# EAGLE design PCM-DAC (EAGLE 7.3.0)
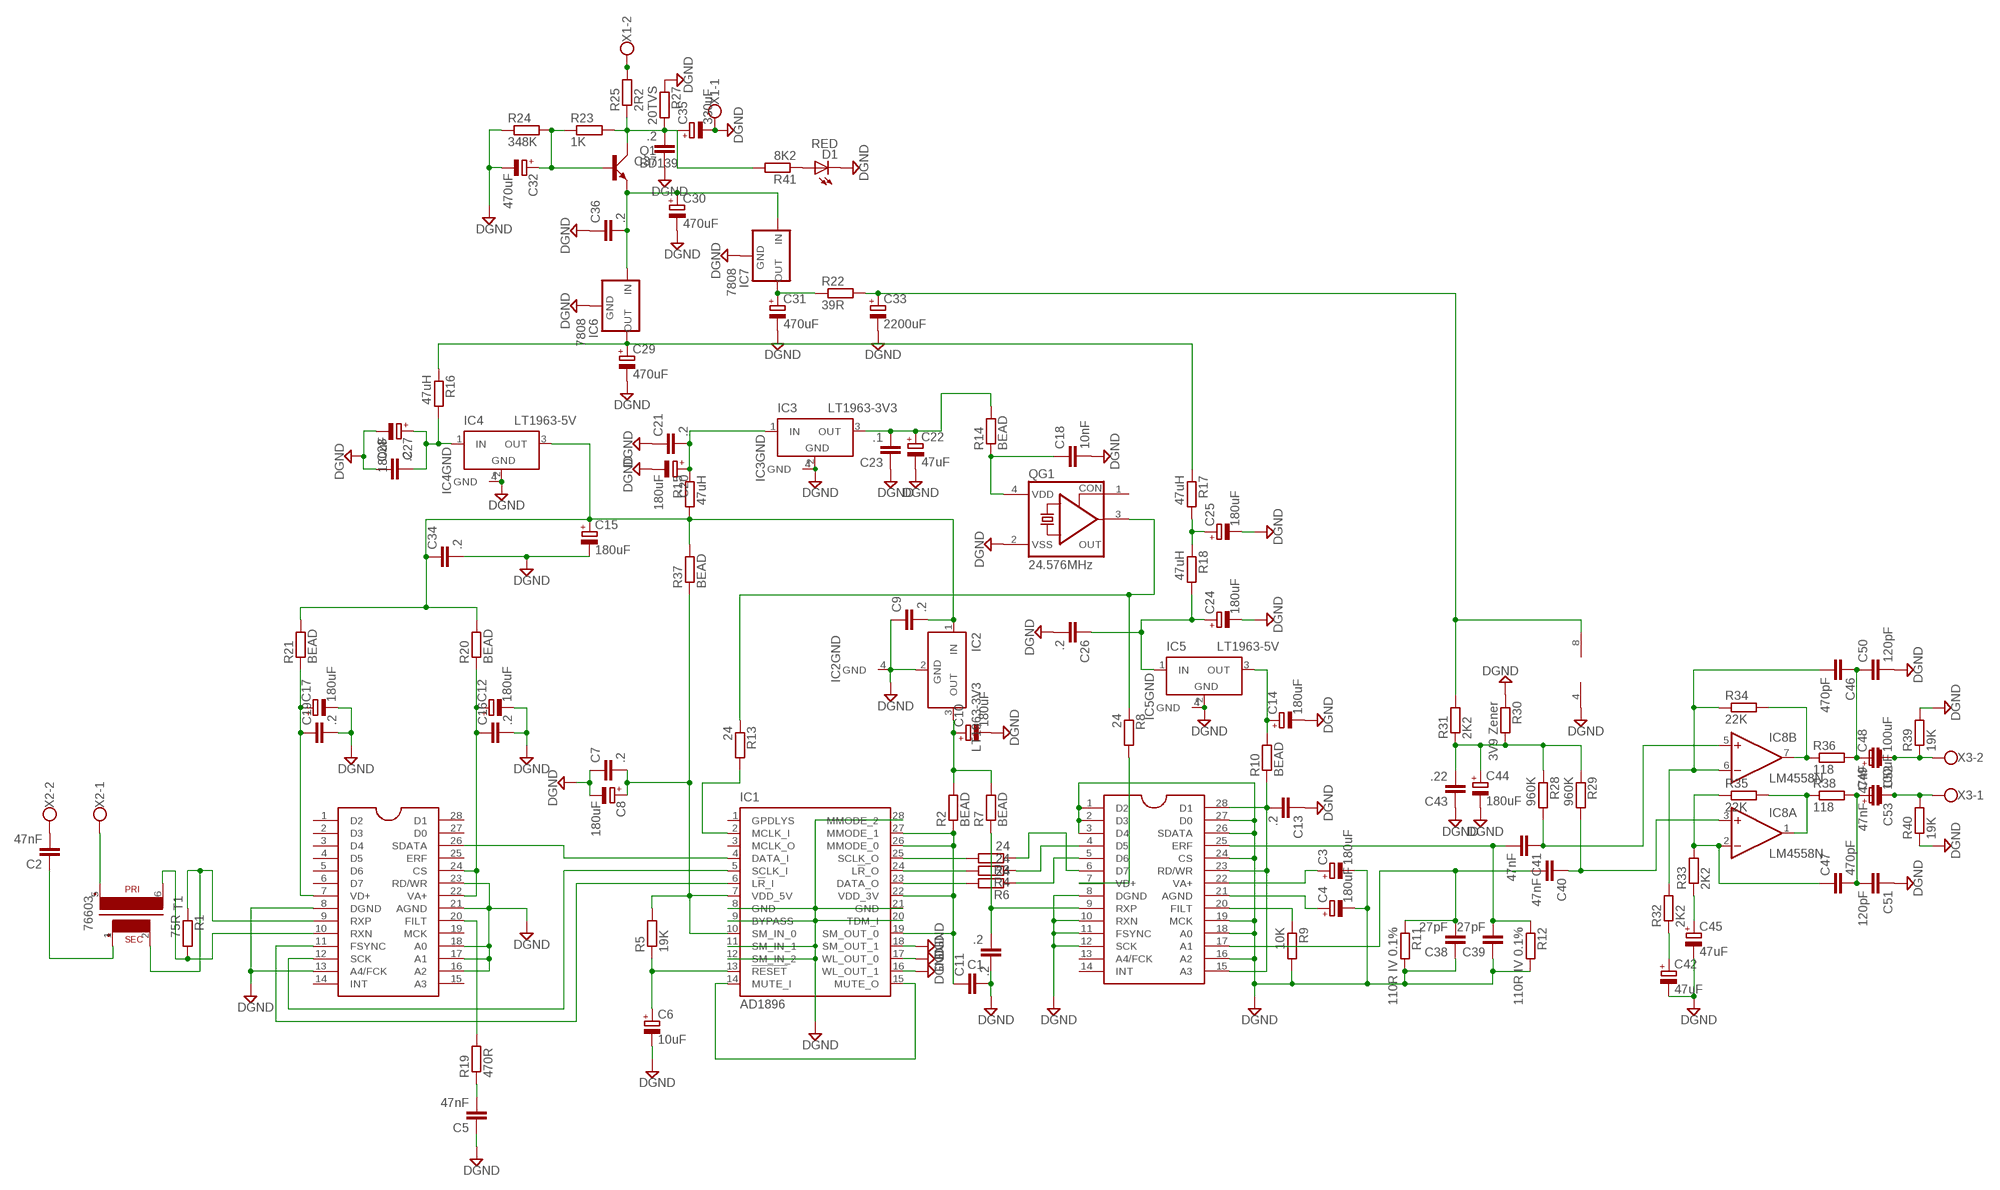
[diagram p0: schematic, sheet 1]

## Parts
C1  .2  C-EUC1210K  [C1210K]
C2  47nF  C-EU050-075X075  [C050-075X075]
C3  180uF  CPOL-EUE3.5-8  [E3,5-8]
C4  180uF  CPOL-EUE3.5-8  [E3,5-8]
C5  47nF  C-EU050-075X075  [C050-075X075]
C6  10uF  CPOL-EUE2.5-7  [E2,5-7]
C7  .2  C-EUC1210K  [C1210K]
C8  180uF  CPOL-EUE3.5-8  [E3,5-8]
C9  .2  C-EUC1210K  [C1210K]
C10  180uF  CPOL-EUE3.5-8  [E3,5-8]
C11  .2  C-EUC1210K  [C1210K]
C12  180uF  CPOL-EUE3.5-8  [E3,5-8]
C13  .2  C-EUC1210K  [C1210K]
C14  180uF  CPOL-EUE3.5-8  [E3,5-8]
C15  180uF  CPOL-EUE3.5-8  [E3,5-8]
C16  .2  C-EUC1210K  [C1210K]
C17  180uF  CPOL-EUE3.5-8  [E3,5-8]
C18  10nF  C-EUC1210K  [C1210K]
C19  .2  C-EUC1210K  [C1210K]
C20  180uF  CPOL-EUE3.5-8  [E3,5-8]
C21  .2  C-EUC1210K  [C1210K]
C22  47uF  CPOL-EUE3.5-8  [E3,5-8]
C23  .1  C-EUC1210K  [C1210K]
C24  180uF  CPOL-EUE3.5-8  [E3,5-8]
C25  180uF  CPOL-EUE3.5-8  [E3,5-8]
C26  .2  C-EUC1210K  [C1210K]
C27  180uF  CPOL-EUE3.5-8  [E3,5-8]
C28  .2  C-EUC1210K  [C1210K]
C29  470uF  CPOL-EUE5-10.5  [E5-10,5]
C30  470uF  CPOL-EUE5-10.5  [E5-10,5]
C31  470uF  CPOL-EUE5-10.5  [E5-10,5]
C32  470uF  CPOL-EUE5-10.5  [E5-10,5]
C33  2200uF  CPOL-EUE7.5-16  [E7,5-16]
C34  .2  C-EUC1210K  [C1210K]
C35  330uF  CPOL-EUE7.5-16  [E7,5-16]
C36  .2  C-EUC1210K  [C1210K]
C37  .2  C-EUC1210K  [C1210K]
C38  27pF  C-EUC1210K  [C1210K]
C39  27pF  C-EUC1210K  [C1210K]
C40  47nF  C-EU050-075X075  [C050-075X075]
C41  47nF  C-EU050-075X075  [C050-075X075]
C42  47uF  CPOL-EUE3.5-8  [E3,5-8]
C43  .22  C-EUC1210K  [C1210K]
C44  180uF  CPOL-EUE5-10.5  [E5-10,5]
C45  47uF  CPOL-EUE3.5-8  [E3,5-8]
C46  470pF  C-EUC1210K  [C1210K]
C47  470pF  C-EUC1210K  [C1210K]
C48  100uF  CPOL-EUE5-10.5  [E5-10,5]
C49  100uF  CPOL-EUE5-10.5  [E5-10,5]
C50  120pF  C-EUC1210K  [C1210K]
C51  120pF  C-EUC1210K  [C1210K]
C52  47nF  C-EU050-075X075  [C050-075X075]
C53  47nF  C-EU050-075X075  [C050-075X075]
D1  RED  SFH482  [SFH482]
IC1  AD1896  AD1896JN  [DIL28-6]
IC2  LT1963-3V3  LT1129CST5  [SOT223]
IC3  LT1963-3V3  LT1129CST5  [SOT223]
IC4  LT1963-5V  LT1129CST5  [SOT223]
IC5  LT1963-5V  LT1129CST5  [SOT223]
IC6  7808  78XXL  [78XXL]
IC7  7808  78XXL  [78XXL]
IC8  LM4558N  [DIL08]
Q1  BD139  [TO126AV]
QG1  24.576MHz  CRYSTAL_RES-1100S  [1100S]
R1  75R  R-EU_0309/12  [0309/12]
R2  BEAD  R-EU_R1210  [R1210]
R3  24  R-EU_R1210  [R1210]
R4  24  R-EU_R1210  [R1210]
R5  19K  R-EU_0204/7  [0204/7]
R6  24  R-EU_R1210  [R1210]
R7  BEAD  R-EU_R1210  [R1210]
R8  24  R-EU_R1210  [R1210]
R9  10K  R-EU_R1210  [R1210]
R10  BEAD  R-EU_R1210  [R1210]
R11  110R IV 0.1%  R-EU_0309/12  [0309/12]
R12  110R IV 0.1%  R-EU_0309/12  [0309/12]
R13  24  R-EU_R1210  [R1210]
R14  BEAD  R-EU_R1210  [R1210]
R15  47uH  R-EU_0309/12  [0309/12]
R16  47uH  R-EU_0309/12  [0309/12]
R17  47uH  R-EU_0309/12  [0309/12]
R18  47uH  R-EU_0309/12  [0309/12]
R19  470R  R-EU_0204/7  [0204/7]
R20  BEAD  R-EU_R1210  [R1210]
R21  BEAD  R-EU_R1210  [R1210]
R22  39R  R-EU_0309/12  [0309/12]
R23  1K  R-EU_R1210  [R1210]
R24  348K  R-EU_R1210  [R1210]
R25  2R2  R-EU_0309/12  [0309/12]
R27  20TVS  R-EU_R5025  [R5025]
R28  960K  R-EU_0309/12  [0309/12]
R29  960K  R-EU_0309/12  [0309/12]
R30  3V9 Zener  R-EU_R1210  [R1210]
R31  2K2  R-EU_R1210  [R1210]
R32  2K2  R-EU_R1210  [R1210]
R33  2K2  R-EU_R1210  [R1210]
R34  22K  R-EU_0309/12  [0309/12]
R35  22K  R-EU_0309/12  [0309/12]
R36  118  R-EU_0309/12  [0309/12]
R37  BEAD  R-EU_R1210  [R1210]
R38  118  R-EU_0309/12  [0309/12]
R39  19K  R-EU_0309/12  [0309/12]
R40  19K  R-EU_0309/12  [0309/12]
R41  8K2  R-EU_R1210  [R1210]
T1  76603  [766-4]
U$1  CS8412  CS8412DIP  [DIL28]
U$2  PCM1794A  CS8412DIP  [DIL28]
X1  W237-02P  [W237-132]
X2  W237-02P  [W237-132]
X3  W237-02P  [W237-132]

## Nets
DGND: C1.1 C3.- C4.- C5.1 C6.- C7.1 C8.- C9.1 C10.- C11.2 C12.- C13.1 C14.- C15.- C16.2 C17.- C18.2 C19.2 C20.- C21.1 C22.- C23.1 C24.- C25.- C26.2 C27.- C28.1 C29.- C30.- C31.- C32.- C33.- C34.2 C35.- C36.1 C37.1 C38.1 C39.1 C42.- C43.1 C44.- C45.- C50.2 C51.1 D1.K(C) IC1.8(GND) IC1.9(BYPASS) IC1.11(SM_IN_1) IC1.12(SM_IN_2) IC1.16(WL_OUT_1) IC1.17(WL_OUT_0) IC1.18(SM_OUT_1) IC1.20(TDM_I) IC1.21(GND) IC1.28(MMODE_2) IC2.2(GND) IC2.4(GND) IC3.2(GND) IC3.4(GND) IC4.2(GND) IC4.4(GND) IC5.2(GND) IC5.4(GND) IC6.GND IC7.GND IC8.4(P:V-) QG1.2(VSS) R9.2 R11.2 R12.2 R24.1 R27.1 R30.1 R39.2 R40.1 U$1.8(DGND) U$1.13(A4/FCK) U$1.16(A2) U$1.17(A1) U$1.18(A0) U$1.21(AGND) U$1.23(RD/WR) U$2.1(D2) U$2.2(D3) U$2.3(D4) U$2.8(DGND) U$2.10(RXN) U$2.11(FSYNC) U$2.12(SCK) U$2.16(A2) U$2.18(A0) U$2.19(MCK) U$2.24(CS) U$2.26(SDATA) U$2.27(D0) X1.1
N$1: C2.2 X2.2
N$2: IC1.14(MUTE_I) IC1.15(MUTE_O)
N$3: T1.5(P1) X2.1
N$4: C2.1 T1.1(S1)
N$5: IC1.4(DATA_I) U$1.26(SDATA)
N$6: IC1.5(SCLK_I) U$1.12(SCK)
N$7: IC1.6(L!R!_I) U$1.11(FSYNC)
N$8: C11.1 IC1.19(SM_OUT_0) IC1.22(VDD_3V) IC1.26(MMODE_0) IC1.27(MMODE_1) R2.1
N$9: C7.2 C8.+ IC1.7(VDD_5V) IC1.10(SM_IN_0) R5.2 R37.1
N$10: C10.+ IC2.3(OUT) R2.2 R7.2
N$11: C9.2 C15.+ C34.1 IC2.1(IN) IC4.3(OUT) R15.2 R20.2 R21.2 R37.2
N$12: IC1.23(DATA_O) R6.2
N$13: IC1.24(L!R!_O) R4.2
N$14: IC1.25(SCLK_O) R3.2
N$15: R4.1 U$2.4(D5)
N$16: R6.1 U$2.5(D6)
N$17: R3.1 U$2.6(D7)
N$18: C1.2 R7.1 U$2.9(RXP)
N$19: C13.2 R10.1 U$2.15(A3) U$2.23(RD/WR) U$2.28(D1)
N$20: R8.2 U$2.7(VD+)
N$21: R9.1 U$2.20(FILT)
N$22: C3.+ U$2.22(VA+)
N$23: C4.+ U$2.21(AGND)
N$24: C14.+ IC5.3(OUT) R10.2
N$25: C39.2 C41.2 R12.1 U$2.25(ERF)
N$26: C38.2 C40.2 R11.1 U$2.17(A1)
N$27: IC1.2(MCLK_I) R13.2
N$28: QG1.3(OUT) R8.1 R13.1
N$29: C20.+ C21.2 IC3.1(IN) R15.1
N$30: C18.1 QG1.4(VDD) R14.1
N$31: C22.+ C23.2 IC3.3(OUT) R14.2
N$32: C27.+ C28.2 IC4.1(IN) R16.2
N$33: C29.+ IC6.OUT R16.1 R17.1
N$34: C24.+ C26.1 IC5.1(IN) R18.2
N$35: C25.+ R17.2 R18.1
N$36: C30.+ C36.2 IC6.IN IC7.IN Q1.E
N$37: C31.+ IC7.OUT R22.1
N$38: C33.+ IC8.8(P:V+) R22.2 R31.2
N$39: R25.2 X1.2
N$40: C32.+ Q1.B R23.1 R24.2
N$41: C35.+ C37.2 Q1.C R23.2 R25.1 R27.2 R41.2
N$42: C41.1 IC8.5(B:+IN) R28.2
N$43: C40.1 IC8.3(A:+IN) R29.2
N$44: C43.2 C44.+ R28.1 R29.1 R30.2 R31.1
N$45: IC8.1(A:OUT) R35.2 R38.1
N$46: C47.1 IC8.2(A:-IN) R33.2 R35.1
N$47: C46.2 IC8.6(B:-IN) R32.2 R34.1
N$48: C42.+ R32.1
N$49: C45.+ R33.1
N$50: IC8.7(B:OUT) R34.2 R36.1
N$51: C46.1 C48.+ C50.1 C52.2 R36.2
N$52: C47.2 C49.+ C51.2 C53.2 R38.2
N$53: R1.2 T1.6(P2) U$1.10(RXN)
N$54: C48.- C52.1 R39.1 X3.2
N$55: C49.- C53.1 R40.2 X3.1
N$56: D1.A R41.1
N$57: R1.1 T1.2(S2) U$1.9(RXP)
N$58: C17.+ C19.1 R21.1 U$1.7(VD+)
N$60: C12.+ C16.1 R20.1 U$1.22(VA+) U$1.24(CS)
N$61: C5.2 R19.1
N$63: R19.2 U$1.20(FILT)
N$89: C6.+ IC1.13(!RESET) R5.1
Unconnected: IC1.1(GPDLYS) IC1.3(MCLK_O) QG1.1(CON) U$1.1(D2) U$1.2(D3) U$1.3(D4) U$1.4(D5) U$1.5(D6) U$1.6(D7) U$1.14(INT) U$1.15(A3) U$1.19(MCK) U$1.25(ERF) U$1.27(D0) U$1.28(D1) U$2.13(A4/FCK) U$2.14(INT)

## Library data of the parts
C1 C2 C5 C7 C9 C11 C13 C16 C18 C19 C21 C23 C26 C28 C34 C36-C41 C43 C46 C47 C50-C53 = resistor:C-EU: CAPACITOR, European symbol
C3 C4 C6 C8 C10 C12 C14 C15 C17 C20 C22 C24 C25 C27 C29-C33 C35 C42 C44 C45 C48 C49 = resistor:CPOL-EU: POLARIZED CAPACITOR, European symbol
D1 = led:SFH482: IR LED infrared emitting diode, Infineon
IC1 = analog-devices:AD1896: Stereo Asynchronous Sample Rate Converter Auto generated by make-symbol-device-package-bsdl.ulp Rev. 33 Source: http://www.analog.com/static/imported-files/data_sheets/AD1896.pdf
IC2-IC5 = linear-technology:LT1129CST5: VOLTAGE REGULATOR with shutdown
IC6 IC7 = v-reg:78XXL: VOLTAGE REGULATOR
IC8 = linear:*4558: OP AMP
Q1 = transistor-power:BD139: NPN TRANSISTOR
QG1 = crystal:CRYSTAL_RES-: CRYSTAL RESONATOR; OC_FARNELL: unknown; OC_NEWARK: unknown
R1-R25 R27-R41 = resistor:R-EU_: RESISTOR, European symbol
T1 = pulse:76603
U$1 U$2 = cirrus-dar:CS8412: 24bit 55kHz Digital Audio Receiver
X1-X3 = con-wago-508:W237-02P: WAGO SREW CLAMP

## Board
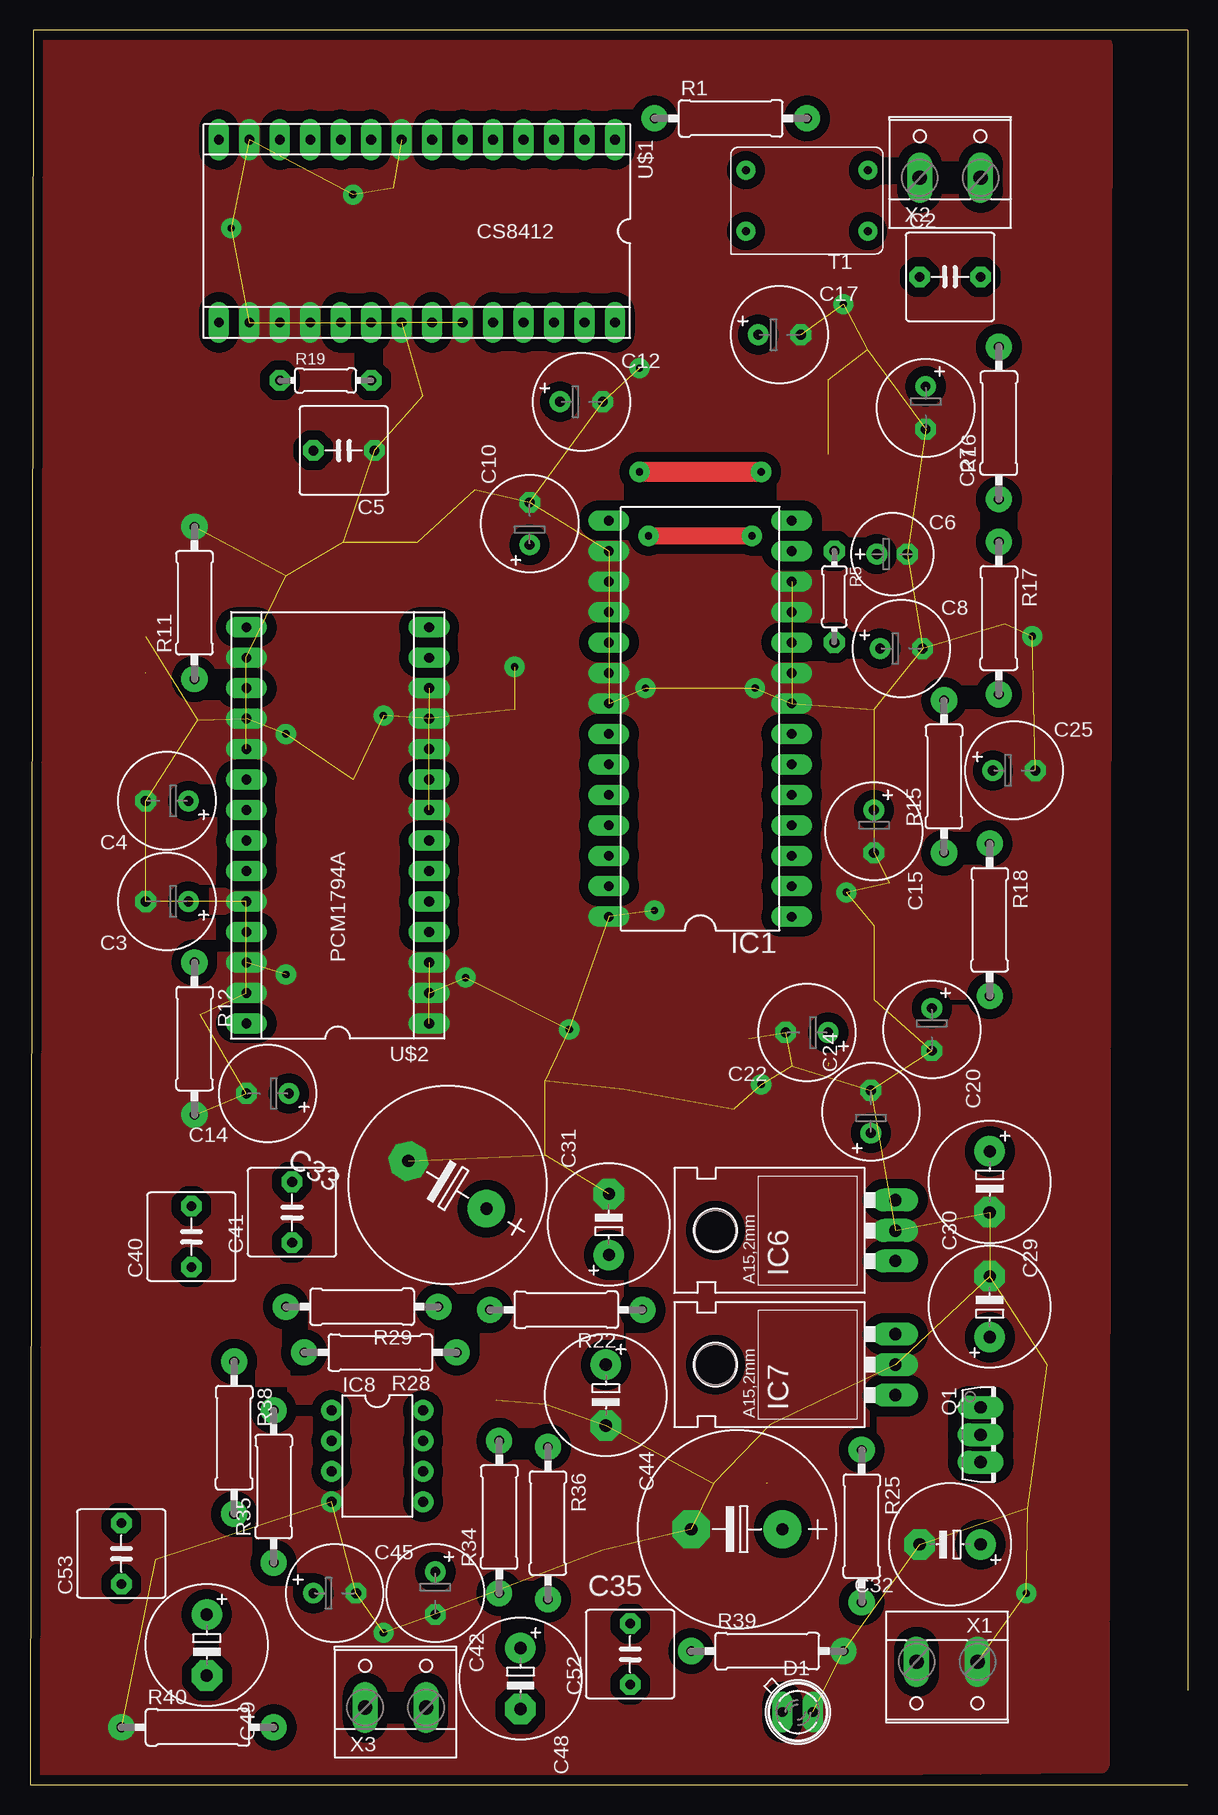
[diagram p1: board, top side]
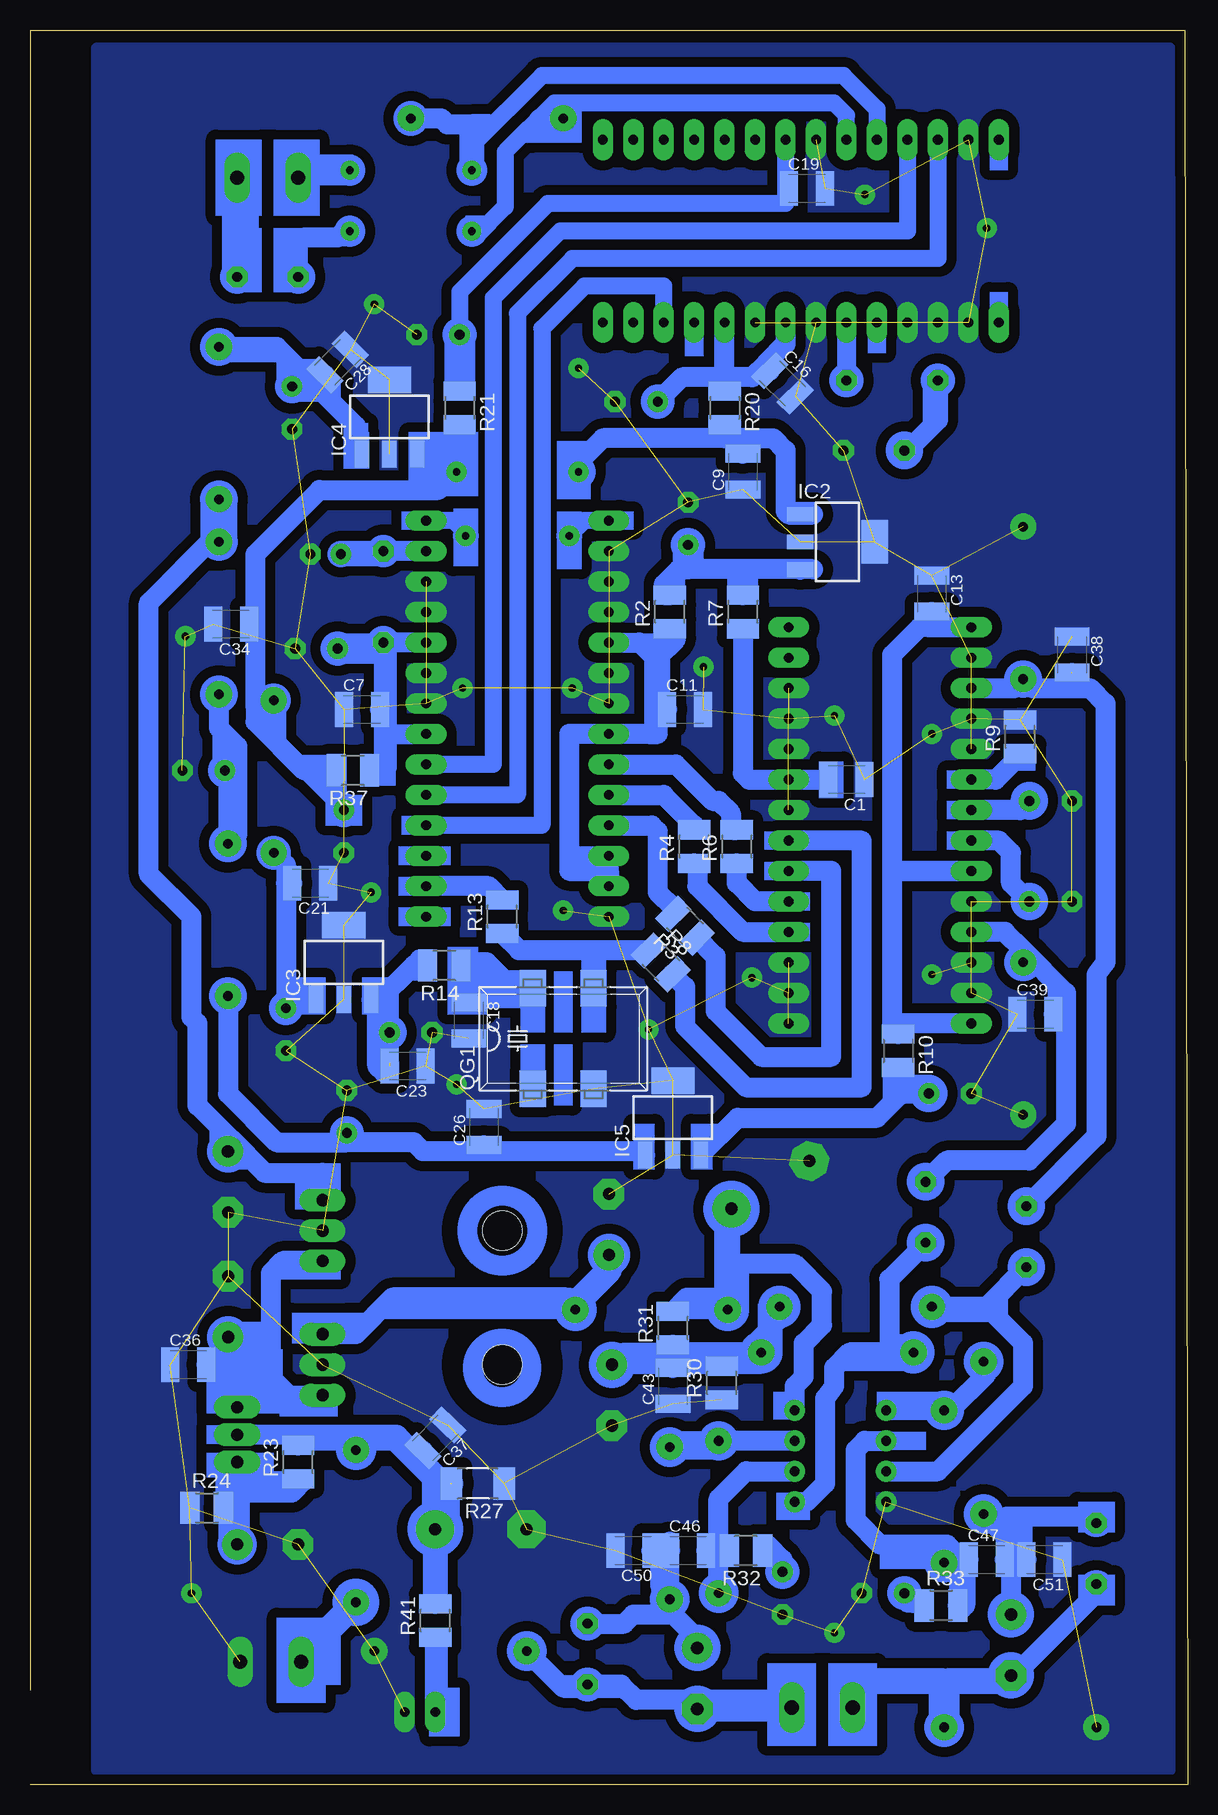
[diagram p2: board, bottom side, seen from below]

Size 96.52 x 146.28 mm. Coordinates in mm from the lower left corner, seen from the top.
Outline: 96.52,0 0,0 0.25,146.28 96.52,146.28 96.52,7.87
Copper layers (1*16): Top 0.035mm / dielectric 1.5mm / Bottom 0.035mm
Design rules "default": minimum track width 10mil, minimum drill 24mil, track to track 8mil, track to pad 8mil, pad to pad 8mil, via to via 8mil, smd to smd 8mil, copper to edge 30mil, drill to drill 8mil, minimum pad ring 18mil, minimum via ring 8mil, stop-mask expansion 4mil, vias tented up to drill 0mil, thermal gap 10mil

### Footprints (pad centres in the part's own frame; a part is rotated, then mirrored left to right if it is on the bottom)
C1210K = smd 1.5 x 2.9: 1 -1.5,0; 2 1.5,0
C050-075X075 = drill 0.813 octagon: 1 -2.54,0; 2 2.54,0
E3,5-8 = drill 0.813 pad 1.6: + -1.778,0 | drill 0.813 pad 1.6 octagon: - 1.778,0
E2,5-7 = drill 0.813 pad 1.6: + -1.27,0 | drill 0.813 pad 1.6 octagon: - 1.27,0
E5-10,5 = drill 1.016 pad 2.54: + -2.54,0 | drill 1.016 pad 2.54 octagon: - 2.54,0
E7,5-16 = drill 1.016 pad 3.15: + -3.81,0 | drill 1.016 pad 3.15 octagon: - 3.81,0
SFH482 = drill 0.813 long: A -1.27,0; K 1.27,0
DIL28-6 = drill 0.813 pad 1.676 long: 1 -16.51,-7.62; 2 -13.97,-7.62; 3 -11.43,-7.62; 4 -8.89,-7.62; 5 -6.35,-7.62; 6 -3.81,-7.62; 7 -1.27,-7.62; 8 1.27,-7.62; 9 3.81,-7.62; 10 6.35,-7.62; 11 8.89,-7.62; 12 11.43,-7.62; 13 13.97,-7.62; 14 16.51,-7.62; 15 16.51,7.62; 16 13.97,7.62; 17 11.43,7.62; 18 8.89,7.62; 19 6.35,7.62; 20 3.81,7.62; 21 1.27,7.62; 22 -1.27,7.62; 23 -3.81,7.62; 24 -6.35,7.62; 25 -8.89,7.62; 26 -11.43,7.62; 27 -13.97,7.62; 28 -16.51,7.62
SOT223 = smd 1.219 x 2.235: 1 -2.311,-3.099; 2 0,-3.099; 3 2.311,-3.099 | smd 3.6 x 2.2: 4 0,3.099
78XXL = drill 1.016 long: GND 0,-3.81; IN -2.54,-3.81; OUT 2.54,-3.81 | hole 3.302: 0,11.176
DIL08 = drill 0.813 pad 1.27: 1 -3.81,-3.81; 2 -1.27,-3.81; 3 1.27,-3.81; 4 3.81,-3.81; 5 3.81,3.81; 6 1.27,3.81; 7 -1.27,3.81; 8 -3.81,3.81
TO126AV = drill 1.016 long: B 2.286,-1.27; C 0,-1.27; E -2.286,-1.27
1100S = smd 2.184 x 3.048: 1 -2.54,-4.191; 2 2.54,-4.191; 3 2.54,4.191; 4 -2.54,4.191
0309/12 = drill 0.8 pad 2.184: 1 -6.35,0; 2 6.35,0
R1210 = smd 1.6 x 2.7: 1 -1.4,0; 2 1.4,0
0204/7 = drill 0.813 octagon: 1 -3.81,0; 2 3.81,0
R5025 = smd 1.8 x 2.7: 1 -2.2,0; 2 2.2,0
766-4 = drill 0.65: 1 -5.08,2.54; 2 5.08,2.54; 5 -5.08,-2.54; 6 5.08,-2.54
DIL28 = drill 0.813 pad 1.676 long: 1 -16.51,-7.62; 2 -13.97,-7.62; 3 -11.43,-7.62; 4 -8.89,-7.62; 5 -6.35,-7.62; 6 -3.81,-7.62; 7 -1.27,-7.62; 8 1.27,-7.62; 9 3.81,-7.62; 10 6.35,-7.62; 11 8.89,-7.62; 12 11.43,-7.62; 13 13.97,-7.62; 14 16.51,-7.62; 15 16.51,7.62; 16 13.97,7.62; 17 11.43,7.62; 18 8.89,7.62; 19 6.35,7.62; 20 3.81,7.62; 22 -1.27,7.62; 23 -3.81,7.62; 24 -6.35,7.62; 25 -8.89,7.62; 26 -11.43,7.62; 27 -13.97,7.62; 28 -16.51,7.62 | drill 0.813 pad 1.6 long: 21 1.27,7.62
W237-132 = drill 1.194 long: 1 -2.54,-0.635; 2 2.54,-0.635

### Placement (x,y rotation side)
C1  28.45,83.8 180 bottom
C2  76.71,125.71 0 top
C3  11.43,73.64 180 top
C4  11.43,82.02 180 top
C5  26.16,111.23 180 top
C6  71.88,102.6 0 top
C7  68.83,89.64 0 bottom
C8  72.64,94.72 0 top
C9  37.08,109.45 90 bottom
C10  41.66,105.14 90 top
C11  41.91,89.64 359.8 bottom
C12  45.97,115.3 0 top
C13  21.34,99.29 270 bottom
C14  19.81,57.64 180 top
C15  70.36,79.48 270 top
C16  33.78,116.82 314.9 bottom
C17  62.48,120.88 0 top
C18  59.94,63.73 270 bottom
C19  31.75,133.08 0 bottom
C20  75.18,62.97 270 top
C21  73.15,75.16 180 bottom
C22  64.77,62.72 180 top
C23  65.02,59.92 180 bottom
C24  70.1,56.11 90 top
C25  82.04,84.56 0 top
C26  58.67,54.84 90 bottom
C27  74.68,114.79 270 top
C28  70.87,118.6 225 bottom
C29  80.01,50.27 269.8 top
C30  80.01,39.86 90 top
C31  48.26,46.72 90 top
C32  76.71,20.05 180 top
C33  34.8,50.02 148.6 top
C34  79.76,96.75 180 bottom
C35  58.93,21.32 180 top
C36  83.31,35.03 0 bottom
C37  62.74,28.94 225.8 bottom
C38  9.65,94.21 270 bottom
C39  12.7,64.24 0 bottom
C40  13.46,45.7 90 top
C41  21.84,47.73 90 top
C42  33.78,15.98 270 top
C43  42.93,33.25 90 bottom
C44  48.01,32.49 270 top
C45  25.4,15.98 0 top
C46  41.66,19.54 0 bottom
C47  16.76,18.78 0 bottom
C48  40.89,8.87 270 top
C49  14.73,11.66 270 top
C50  46.23,19.54 180 bottom
C51  11.94,18.78 180 bottom
C52  50.04,10.9 90 top
C53  7.62,19.28 90 top
D1  64.01,6.08 0 top
IC1  55.88,88.88 90 top
IC2  29.21,103.61 270 bottom
IC3  70.36,68.56 0 bottom
IC4  66.55,114.03 0 bottom
IC5  42.93,55.61 0 bottom
IC6  68.33,46.21 90 top
IC7  68.33,35.03 90 top
IC8  28.96,27.41 270 top
Q1  80.52,29.19 270 top
QG1  52.07,62.21 0 bottom
R1  58.42,138.92 0 top
R2  43.18,97.77 90 bottom
R3  41.91,71.61 135 bottom
R4  41.15,78.21 90 bottom
R5  67.06,99.04 270 top
R6  37.59,78.21 90 bottom
R7  37.08,97.77 90 bottom
R8  43.94,68.56 314.6 bottom
R9  13.97,87.36 90 bottom
R10  24.13,61.19 270 bottom
R11  13.72,98.53 90 top
R12  13.72,62.21 270 top
R13  57.15,72.37 90 bottom
R14  61.98,68.31 180 bottom
R15  76.2,84.05 90 top
R16  80.77,113.52 90 top
R17  80.77,97.26 270 top
R18  80.01,72.12 270 top
R19  24.64,117.07 0 top
R20  38.61,114.79 270 bottom
R21  60.71,114.79 270 bottom
R22  44.7,39.6 180 top
R23  74.17,26.9 90 bottom
R24  81.79,23.09 0 bottom
R25  69.34,21.57 270 top
R27  59.18,25.13 180 bottom
R28  29.21,36.05 180 top
R29  27.69,39.86 180 top
R30  38.86,33.51 90 bottom
R31  42.93,38.08 90 bottom
R32  36.83,19.54 180 bottom
R33  20.57,14.97 0 bottom
R34  39.12,22.33 90 top
R35  20.32,24.87 90 top
R36  43.18,21.82 270 top
R37  69.6,84.56 180 bottom
R38  17.02,28.94 270 top
R39  61.47,11.16 0 top
R40  13.97,4.81 0 top
R41  62.74,13.7 90 bottom
T1  64.77,132.06 180 top
U$1  32.26,129.52 180 top
U$2  25.65,79.99 90 top
X1  76.45,9.63 180 top
X2  76.71,134.6 0 top
X3  30.48,7.09 0 top

### Tracks (layer width: path | path; a pad name or v marks a point on that pad's centre or on a via)
DGND  (via drill 0.6 pad 1.68)  (113 unrouted)
  other vias: 60.45,91.42 51.31,91.42 52.07,72.88 67.82,123.42 26.92,132.57 16.76,129.77 50.8,118.09 36.32,67.29 40.39,93.2 68.07,74.4 29.46,89.13 21.34,87.61 21.34,67.54 60.96,58.4 44.96,62.97 83.57,95.74 83.06,15.98 29.46,12.68
  pour Bottom (isolate 0.838, rank 5, no thermals): 90.93,144.76 1.52,144.76 1.52,1.25 90.93,1.25
  pour Top (isolate 0.813, no thermals): 89.15,1.76 0.51,1 1.02,145.52 89.41,145.01
N$1
  Bottom 1.676: X2.2 C2.2
N$2  (via drill 0.6 pad 1.68)
  Top 1.422: v51.56,104.12 v60.2,104.12
  Bottom 1.422: v51.56,104.12 50.29,105.39 IC1.15 | v60.2,104.12 60.2,104.37 61.21,105.39 IC1.14
N$3
  Bottom 1.676: X2.1 73.53,134.6 T1.5
N$4
  Bottom 1.676: C2.1 74.17,128.5 73.66,129.01 70.87,129.01 70.36,129.52 T1.1
N$5
  Bottom 1.422: IC1.4 53.85,79.99 53.85,121.39 50.29,124.95 43.69,124.95 U$1.26
N$6
  Bottom 1.422: IC1.5 55.88,82.53 55.88,122.66 51.31,127.23 20.83,127.23 U$1.12
N$7
  Bottom 1.422: U$1.11 23.37,129.52 52.32,129.52 57.91,123.93 57.91,85.07 IC1.6
N$8
  Bottom 1.676: IC1.19 45.72,95.23 44.45,93.96 44.45,88.12 | 44.45,88.12 44.96,87.61 | 44.96,87.61 IC1.22 51.56,87.61 51.56,76.18 48.26,76.18 | 44.96,87.61 44.18,87.61 44.18,89.39 C11.1 | 48.26,76.18 IC1.26 | 48.26,76.18 IC1.27 | 44.45,88.12 44.2,87.86 44.2,93.96 42.67,95.48 42.67,96.25 43.18,96.25 R2.1
N$9
  Bottom 1.422: C8.+ 70.36,95.23 R5.2
  Bottom 1.676: IC1.10 66.8,95.23 | 66.8,95.23 R5.2 | 66.8,87.61 IC1.7 | 66.8,95.23 66.8,89.64 | 66.8,89.64 66.8,87.61 | 66.8,89.64 C7.2 | 66.8,87.61 66.8,84.69 66.93,84.56 R37.1
N$10
  Bottom 1.676: IC2.3 32.28,101.33 | 31.24,101.33 32.28,101.33 | 32.28,101.33 37.34,101.33 | 41.66,101.33 C10.+ | 41.66,101.33 42.42,101.33 43.69,100.06 43.69,99.29 43.56,99.17 R2.2 | R7.2 37.08,101.07 37.34,101.33 | 37.34,101.33 41.66,101.33
N$11  (via drill 0.6 pad 1.68)
  Top 1.676: v50.8,109.45 v60.96,109.45
  Bottom 1.422: C34.1 77.75,96.75 77.72,89.9 | C15.+ 70.36,82.02 72.39,84.05 72.39,83.55 71.12,82.28 | IC4.3 64.01,110.7 64.01,107.93
  Bottom 1.676: 73.41,84.56 R37.2 | 36.07,112.25 36.58,112.25 | 36.58,112.25 37.08,112.25 | 37.08,112.25 38.61,112.25 | 38.61,112.25 48.77,112.25 50.8,110.22 v50.8,109.45 | 38.61,112.25 R20.2 | R21.2 60.71,109.71 v60.96,109.45 62.48,107.93 64.01,107.93 72.39,107.93 77.72,102.6 77.72,89.9 | 73.41,84.56 71.12,82.28 | 77.72,89.9 77.72,88.63 73.66,84.56 73.41,84.56 | 36.07,112.25 37.08,111.23 37.08,110.98 | 37.08,112.25 C9.2 36.58,111.46 36.58,112.25 | 36.07,112.25 34.54,112.25 33.53,111.23 33.53,106.15 33.27,105.9 31.24,105.9 31.27,105.92 IC2.1 | R15.2 76.71,89.9 77.72,89.9
N$12
  Bottom 1.676: IC1.23 42.67,85.07 39.62,82.02 39.12,82.02 38.1,81.01 38.1,79.74 37.98,79.61 R6.2
N$13
  Bottom 1.676: IC1.24 43.69,82.53 41.15,79.99 R4.2
N$14
  Bottom 1.676: IC1.25 44.7,79.99 44.2,79.48 44.2,74.4 42.93,73.13 42.93,72.62 R3.2
N$15
  Bottom 1.676: R4.1 40.89,76.56 40.89,74.91 37.08,71.1 U$2.4
N$16
  Bottom 1.676: U$2.5 36.07,73.64 37.59,75.16 R6.1
N$17
  Bottom 1.676: U$2.6 29.72,76.18 29.72,60.69 35.56,60.69 39.37,64.5 39.37,69.07 R3.1
N$18
  Bottom 1.676: C1.2 U$2.9 36.58,83.8 37.08,84.31 R7.1
N$19
  Bottom 1.676: U$2.28 24.38,63.48 | 24.64,76.18 24.64,63.48 24.38,63.48 | 24.64,76.18 24.64,94.21 22.35,96.5 21.59,96.5 | 21.59,96.5 U$2.15 | 24.38,76.18 U$2.23 24.64,76.18 | C13.2 21.59,97.54 21.59,96.5 | R10.1 24.38,62.85 24.38,63.48
N$20
  Bottom 1.676: R8.2 41.91,66.51 41.91,63.23 36.83,58.15 27.18,58.15 27.18,78.72 U$2.7
N$21
  Bottom 1.676: 18.29,83.8 U$2.20 16,83.8 13.97,85.83 R9.1
N$22
  Bottom 1.676: C3.+ 14.73,75.16 14.73,77.7 15.75,78.72 U$2.22
N$23
  Bottom 1.676: C4.+ 13.97,81.26 U$2.21
N$24
  Bottom 1.676: R10.2 24.13,57.64 | 24.13,57.64 C14.+ | IC5.3 37.52,55.61 25.91,55.61 24.13,57.38 24.13,57.64
N$25
  Bottom 1.676: 13.72,69.58 15.24,71.1 U$2.25 | R12.1 13.72,69.58 | 13.72,69.58 10.16,66.02 10.16,63.99 | 10.16,63.99 10.67,64.24 C39.2 | 10.16,63.99 10.16,55.1 13.21,52.05 20.07,52.05 C41.2
N$26  (1 unrouted)
  Bottom 1.676: U$2.17 14.48,91.42 R11.1 12.95,91.42 9.65,91.42 | 9.65,91.42 9.65,92.69 | 9.65,91.42 8.13,91.42 6.86,90.15 6.86,68.56 7.62,67.54 7.62,54.08 C40.2
N$27
  Bottom 1.676: R13.2 58.29,74.91 IC1.2
N$28
  Bottom 1.676: R13.1 55.76,69.58 49.53,69.58 | R8.1 44.96,69.58 49.53,69.58 | QG1.3 49.53,69.58
N$29
  Bottom 1.676: R15.1 75.18,76.69 75.18,75.16 | 75.18,75.16 75.18,65.77 | 75.18,65.77 C20.+ | C21.2 75.18,75.16 | IC3.1 72.97,65.77 75.18,65.77
N$30
  Bottom 1.676: QG1.4 55.25,67.04 56.9,67.04 58.42,68.56 60.45,68.56 | 60.45,68.56 60.2,68.31 59.69,68.31 59.69,65.77 60.45,65.51 60.71,65.51 C18.1 | 60.45,68.56 60.58,68.44 R14.1
N$31  (1 unrouted)
  Bottom 1.676: 67.56,62.72 67.56,59.92 67.06,59.42 66.55,59.42 66.55,60.18 | 67.56,62.72 67.56,65.26 | C22.+ 67.56,62.72 | 67.56,65.26 67.77,65.46 IC3.3 | 67.56,65.26 64.52,68.31 | 64.52,68.31 64.01,68.81 63.5,68.81 63.5,68.31 | 63.5,68.31 64.52,68.31 | 63.5,68.31 R14.2
N$32
  Bottom 0.406: 69.34,111.23 69.04,110.93 IC4.1
  Bottom 1.676: R16.2 75.95,119.87 73.53,117.45 | 73.53,117.45 69.34,113.26 69.34,111.23 | C28.2 72.64,116.82 73.15,116.82 73.41,116.57 C27.+ 74.17,117.07 73.91,117.07 73.53,117.45
N$33
  Bottom 1.676: R16.1 80.77,104.12 | 80.77,104.12 R17.1 | 80.77,104.12 81.03,104.12 86.61,98.53 86.61,75.93 83.06,72.37 83.06,63.99 82.55,63.48 82.55,56.62 79.76,53.83 | 79.76,53.83 76.96,51.03 72.14,51.03 IC6.OUT | C29.+ 79.76,53.07 79.76,53.83
N$34
  Bottom 1.676: IC5.1 45.54,52.81 58.67,52.81 | 58.67,52.81 63.75,52.81 64.52,53.57 70.1,53.57 | C24.+ 70.1,53.57 | C26.1 58.67,52.81 | R18.2 80.01,57.64 75.95,53.57 70.1,53.57
N$35
  Bottom 1.676: R17.2 80.77,88.12 79.25,86.59 79.25,84.56 | 79.25,84.56 79.25,79.23 R18.1 | C25.+ 79.25,84.56
N$36
  Bottom 1.676: IC6.IN 75.44,43.67 76.45,42.65 76.45,37.32 | 76.45,37.32 76.45,34.02 | 76.45,34.02 74.93,32.49 IC7.IN | 76.45,37.32 C30.+ 79.25,37.32 76.96,35.03 C36.2 | Q1.E 76.96,33.76 76.45,33.76 76.45,34.02
N$37
  Bottom 1.016: 51.82,40.62 51.56,40.62 51.31,40.62
  Bottom 1.676: 51.82,40.62 66.29,40.62 69.34,37.57 IC7.OUT | R22.1 51.56,40.62
  Bottom 2.184: C31.+ 48.26,42.91 51.05,40.11 R22.1
N$38
  Bottom 1.676: R31.2 41.79,40.62 38.86,40.62 38.86,40.11 R22.2 | IC8.8 32.77,33.25 32,34.02 32,36.81 30.48,38.33 30.48,41.13 32.77,43.41 38.35,43.41
  Bottom 2.184: R22.2 38.35,43.41 38.35,47.73 38.1,47.99 | 37.85,48.24 38.1,47.99 | C33.+ 38.1,47.99
N$39
  Bottom 2.184: R25.2 73.91,10.65 X1.2 73.91,10.14
N$40
  Bottom 1.676: C32.+ 78.99,20.3 78.99,24.11 | 78.99,24.11 78.99,24.36 | 78.99,24.36 78.99,26.9 Q1.B | 78.99,24.36 74.68,24.36 73.66,25.38 74.04,25.38 R23.1 | R24.2 80.01,23.99 80.01,23.86 79.76,24.11 78.99,24.11
N$41  (1 unrouted)
  Bottom 1.676: 69.09,29.19 Q1.C | R25.1 69.34,28.94 69.09,29.19 | 69.09,29.19 66.04,29.19 66.04,28.94 | 73.91,28.94 74.17,28.68 R23.2 | C37.2 64.01,27.64 64.01,27.16 62.74,25.89 62.74,25.38 | R41.2 C35.+
  Bottom 2.184: C35.+ 62.74,25.38 | 62.74,25.38 62.74,25.63 66.04,28.94 69.34,28.94 73.91,28.94 | 62.74,25.38 62.48,25.13 61.47,25.13
N$42
  Bottom 1.676: C41.1 24.89,42.14 24.89,36.05 | 24.89,36.05 R28.2 | 24.89,36.05 28.19,36.05 29.46,34.78 29.46,33.25 30.23,32.24 30.23,25.13 31.75,23.6 IC8.5
N$43
  Bottom 1.676: C40.1 16.76,39.86 | 16.76,39.86 16.51,39.86 | 16.76,39.86 R29.2 | IC8.3 20.83,26.14 13.72,33.25 13.72,36.81 16.76,39.86
N$44
  Bottom 1.676: R29.1 34.04,38.84 36.83,36.05 | 36.83,36.05 38.86,36.05 | 38.86,36.05 42.42,36.05 | 42.42,36.05 42.93,36.05 | 42.93,36.05 R31.1 | 42.93,36.05 42.93,35.54 | C43.2 42.93,35.03 42.93,35.54 | R30.2 38.86,36.05 | R28.1 36.83,36.05 | C44.+ 46.99,36.05 42.93,36.05 | 42.42,36.05 42.93,35.54
N$45
  Bottom 1.676: IC8.1 R35.2 19.81,31.22 16.76,34.27 16.76,35.03 R38.1
N$46
  Bottom 1.676: IC8.2 26.92,28.68 27.69,27.92 27.69,22.08 25.65,20.05 20.07,20.05 18.54,18.52 | 18.54,18.52 18.54,14.97 18.8,14.71 19.05,14.71 19.05,15.22 | 19.05,15.22 19.05,18.27 19.56,18.78 20.32,18.78 R35.1 | 19.05,15.22 R33.2 | C47.1 18.52,18.52 18.54,18.52
N$47
  Bottom 1.676: R34.1 39.12,19.54 | 39.12,19.54 39.12,23.86 36.83,26.14 IC8.6 | R32.2 39.12,19.54 | 39.12,19.54 C46.2
N$48
  Bottom 1.676: R32.1 35.05,19.92 35.05,20.05 33.78,18.78 C42.+
N$49
  Bottom 1.676: R33.1 23.37,15.22 23.62,15.47 C45.+
N$50
  Bottom 1.676: IC8.7 R34.2 42.67,28.68 R36.1
N$51
  Bottom 1.676: C46.1 43.18,19.56 43.18,20.3 43.43,20.05 43.94,20.05 | 43.94,20.05 43.94,16.49 43.18,15.73 R36.2 43.18,14.46 42.93,14.2 | C50.1 44.22,20.05 43.94,20.05 | C52.2 46.99,13.44 46.23,14.2 42.93,14.2 | 42.93,14.2 40.89,12.17 C48.+
N$52
  Bottom 1.676: 14.73,18.78 14.73,20.3 R38.2 16.51,22.59 15.75,21.82 15.24,22.33 8.13,22.33 C53.2 | 14.73,18.78 C51.2 C47.2 | 15.24,18.78 14.73,18.78 | 14.73,18.78 C49.+
N$53
  Bottom 1.422: U$1.10 25.91,139.68 28.7,142.47 53.85,142.47 59.69,136.63 59.69,134.85
  Bottom 1.676: T1.6 59.69,134.85 59.69,138.41 | R1.2 62.23,138.92 61.72,138.41 59.69,138.41 | 58.17,138.41 59.69,138.41
N$54
  Bottom 1.676: X3.2 33.66,7.09 40.89,7.09 | 40.89,7.09 45.97,7.09 47.24,8.36 C52.1 50.04,8.11 | C48.- 40.89,7.09 | R39.1 52.07,8.11 50.04,8.11 | 50.04,8.11 47.24,8.11
N$55
  Bottom 1.676: C53.1 7.62,15.98 14.48,9.12 C49.- 14.99,8.87 20.07,8.87 20.32,8.87 | 20.32,8.87 25.91,8.87 27.94,6.84 X3.1 | R40.2 20.32,8.87
N$56
  Bottom 1.676: D1.A R41.1
N$57
  Bottom 1.422: U$1.9 28.45,139.17 29.46,140.19 52.83,140.19 | 52.83,140.19 56.9,136.12 56.9,131.55 59.44,129.01 T1.2 | R1.1 53.59,138.92 52.83,139.68 52.83,140.19
N$58
  Bottom 1.422: U$1.7 33.53,131.81 | 33.53,131.81 53.34,131.81 60.71,124.44 C17.+ | 33.5,133.58 C19.1 33.5,132.57 33.53,131.81
  Bottom 1.676: C17.+ R21.1
N$60
  Bottom 1.676: U$1.22 33.53,120.12 35.18,118.47 | 44.2,115.68 C12.+ 42.16,117.33 38.61,117.33 | C16.1 35.18,118.22 35.18,118.47 | 35.18,118.47 36.32,117.33 38.61,117.33 | 38.61,117.33 U$1.24 | 38.61,117.33 R20.1
N$61
  Bottom 1.676: R19.1 20.83,113.77 23.37,111.23 C5.2
N$63
  Bottom 1.422: U$1.20 R19.2
N$89
  Bottom 1.676: C6.+ 70.36,102.85 R5.1 IC1.13
(copper drawn outside any net)
  shapes: Bottom area x203, Bottom circle x104